# Altium schematic sheet 2mL Socket.SchDoc
size A; SheetNumber: 1; SheetTotal: 1
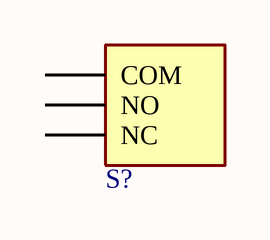
[diagram p0: 2mL Socket.SchDoc]

## Parts
S?  Custom Part  [[Limit Switch] SPDT Limit Switch Carrier Board]  (value not drawn)

## Nets

Not connected (* = marked no-connect by the designer): S? 1(COM) 2(NO) 3(NC)

## Library data of the parts
S? = [Limit Switch] SPDT Limit Switch Carrier Board: Custom PCB